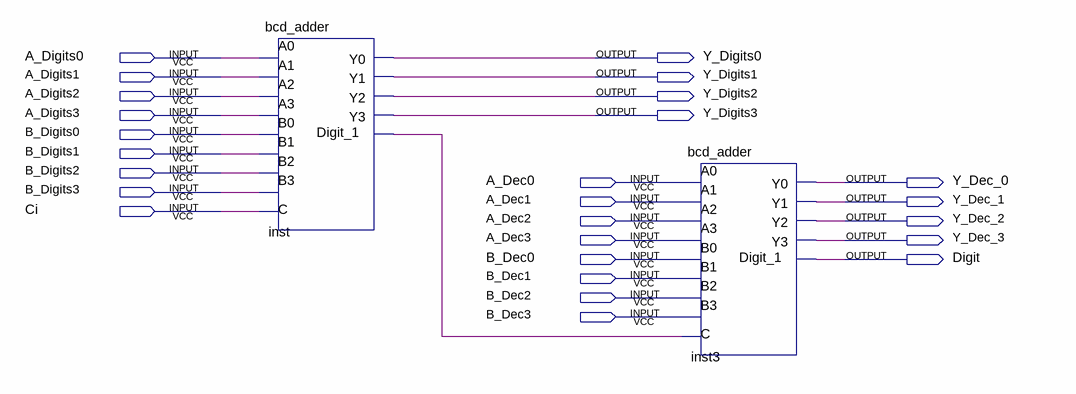
[diagram p0: schematic sheet]
// Quartus schematic dec_bcd_adder.bdf as structural Verilog: 2 symbols, 26 pins
module dec_bcd_adder (
  input  A_Digits0,
  input  A_Digits1,
  input  A_Digits2,
  input  A_Digits3,
  input  B_Digits0,
  input  B_Digits1,
  input  B_Digits2,
  input  A_Dec0,
  input  B_Digits3,
  input  A_Dec1,
  input  Ci,
  input  A_Dec2,
  input  A_Dec3,
  input  B_Dec0,
  input  B_Dec1,
  input  B_Dec2,
  input  B_Dec3,
  output Y_Digits0,
  output Y_Digits1,
  output Y_Digits2,
  output Y_Digits3,
  output Y_Dec_0,
  output Y_Dec_1,
  output Y_Dec_2,
  output Y_Dec_3,
  output Digit
);

  wire inst_digit_1;

  bcd_adder inst (
    .A0(A_Digits0), .B0(B_Digits0), .C(Ci), .A1(A_Digits1), .B1(B_Digits1), .A2(A_Digits2), .B2(B_Digits2),
    .A3(A_Digits3), .B3(B_Digits3), .Y0(Y_Digits0), .Y1(Y_Digits1), .Y2(Y_Digits2), .Y3(Y_Digits3),
    .Digit_1(inst_digit_1));
  bcd_adder inst3 (
    .A0(A_Dec0), .B0(B_Dec0), .C(inst_digit_1), .A1(A_Dec1), .B1(B_Dec1), .A2(A_Dec2), .B2(B_Dec2),
    .A3(A_Dec3), .B3(B_Dec3), .Y0(Y_Dec_0), .Y1(Y_Dec_1), .Y2(Y_Dec_2), .Y3(Y_Dec_3), .Digit_1(Digit));
endmodule
